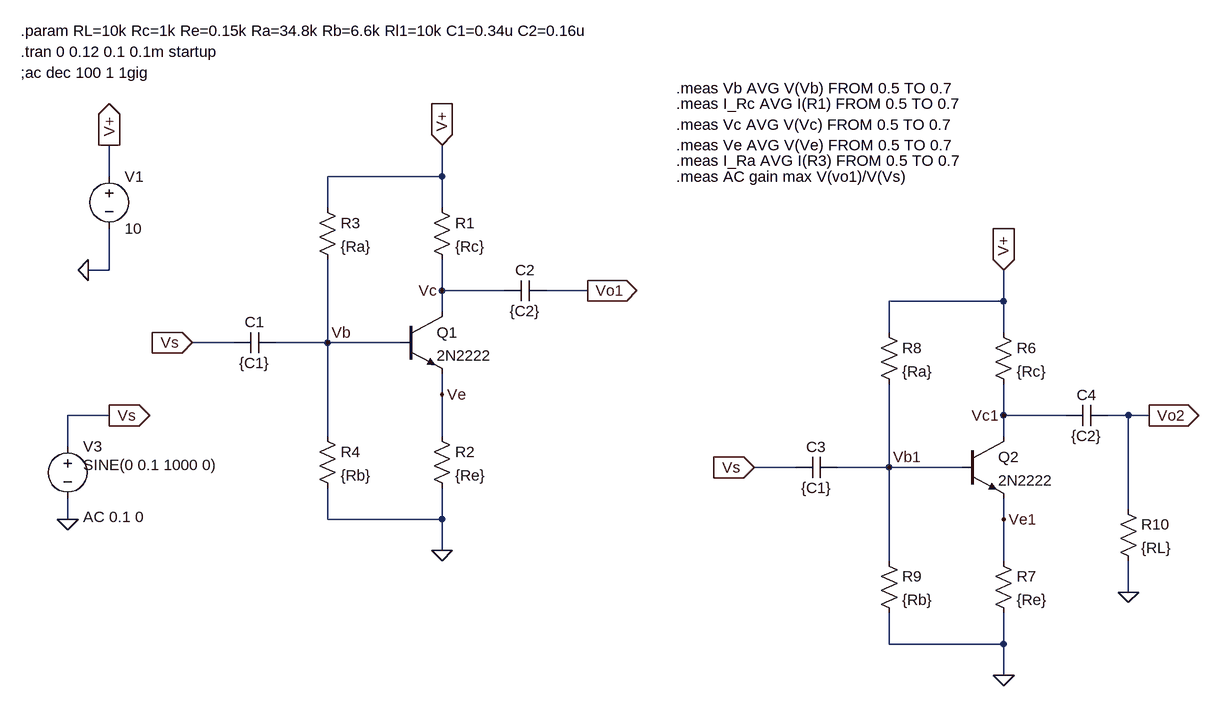
[diagram p0: schematic Assignment1.1.asc]
Assignment1.1.asc, the LTspice schematic file:
Version 4
SHEET 1 1592 680
WIRE -112 -176 -112 -224
WIRE 400 -176 400 -224
WIRE 400 -176 224 -176
WIRE 224 -128 224 -176
WIRE 400 -128 400 -176
WIRE -112 -32 -112 -96
WIRE -112 -32 -144 -32
WIRE 400 0 400 -48
WIRE 496 0 400 0
WIRE 624 0 560 0
WIRE 1264 16 1264 -32
WIRE 1264 16 1088 16
WIRE 400 32 400 0
WIRE 1088 64 1088 16
WIRE 1264 64 1264 16
WIRE 80 80 16 80
WIRE 224 80 224 -48
WIRE 224 80 144 80
WIRE 336 80 224 80
WIRE 400 160 400 128
WIRE -112 192 -176 192
WIRE 1264 192 1264 144
WIRE 1360 192 1264 192
WIRE 1456 192 1424 192
WIRE 1488 192 1456 192
WIRE 224 224 224 80
WIRE 400 224 400 160
WIRE 1264 224 1264 192
WIRE -176 240 -176 192
WIRE 944 272 880 272
WIRE 1088 272 1088 144
WIRE 1088 272 1008 272
WIRE 1200 272 1088 272
WIRE 1456 336 1456 192
WIRE -176 352 -176 320
WIRE 224 352 224 304
WIRE 400 352 400 304
WIRE 400 352 224 352
WIRE 1264 352 1264 320
WIRE 400 400 400 352
WIRE 1088 416 1088 272
WIRE 1264 416 1264 352
WIRE 1456 464 1456 416
WIRE 1088 544 1088 496
WIRE 1264 544 1264 496
WIRE 1264 544 1088 544
WIRE 1264 592 1264 544
FLAG -144 -32 0
FLAG 400 400 0
FLAG -112 -224 V+
IOPIN -112 -224 Out
FLAG 400 -224 V+
IOPIN 400 -224 In
FLAG 624 0 Vo1
IOPIN 624 0 Out
FLAG -176 352 0
FLAG -112 192 Vs
IOPIN -112 192 Out
FLAG 16 80 Vs
IOPIN 16 80 In
FLAG 400 0 Vc
FLAG 224 80 Vb
FLAG 400 160 Ve
FLAG 1264 592 0
FLAG 1264 -32 V+
IOPIN 1264 -32 In
FLAG 1488 192 Vo2
IOPIN 1488 192 Out
FLAG 1456 464 0
FLAG 880 272 Vs
IOPIN 880 272 In
FLAG 1264 192 Vc1
FLAG 1088 272 Vb1
FLAG 1264 352 Ve1
SYMBOL npn 336 32 R0
SYMATTR InstName Q1
SYMATTR Value 2N2222
SYMBOL res 384 -144 R0
SYMATTR InstName R1
SYMATTR Value {Rc}
SYMBOL res 384 208 R0
SYMATTR InstName R2
SYMATTR Value {Re}
SYMBOL res 208 -144 R0
SYMATTR InstName R3
SYMATTR Value {Ra}
SYMBOL res 208 208 R0
SYMATTR InstName R4
SYMATTR Value {Rb}
SYMBOL voltage -112 -192 R0
SYMATTR InstName V1
SYMATTR Value 10
SYMBOL cap 144 64 R90
WINDOW 0 0 32 VBottom 2
WINDOW 3 32 32 VTop 2
SYMATTR InstName C1
SYMATTR Value {C1}
SYMBOL cap 560 -16 R90
WINDOW 0 0 32 VBottom 2
WINDOW 3 32 32 VTop 2
SYMATTR InstName C2
SYMATTR Value {C2}
SYMBOL voltage -176 224 R0
WINDOW 123 24 124 Left 2
WINDOW 39 0 0 Left 0
WINDOW 3 24 44 Left 2
SYMATTR Value2 AC 0.1 0
SYMATTR Value SINE(0 0.1 1000 0)
SYMATTR InstName V3
SYMBOL npn 1200 224 R0
SYMATTR InstName Q2
SYMATTR Value 2N2222
SYMBOL res 1248 48 R0
SYMATTR InstName R6
SYMATTR Value {Rc}
SYMBOL res 1248 400 R0
SYMATTR InstName R7
SYMATTR Value {Re}
SYMBOL res 1072 48 R0
SYMATTR InstName R8
SYMATTR Value {Ra}
SYMBOL res 1072 400 R0
SYMATTR InstName R9
SYMATTR Value {Rb}
SYMBOL cap 1008 256 R90
WINDOW 0 0 32 VBottom 2
WINDOW 3 32 32 VTop 2
SYMATTR InstName C3
SYMATTR Value {C1}
SYMBOL cap 1424 176 R90
WINDOW 0 0 32 VBottom 2
WINDOW 3 32 32 VTop 2
SYMATTR InstName C4
SYMATTR Value {C2}
SYMBOL res 1440 320 R0
SYMATTR InstName R10
SYMATTR Value {RL}
TEXT -248 -400 Left 2 !.param RL=10k Rc=1k Re=0.15k Ra=34.8k Rb=6.6k Rl1=10k C1=0.34u C2=0.16u
TEXT -248 -368 Left 2 !.tran 0 0.12 0.1 0.1m startup
TEXT -248 -336 Left 2 !;ac dec 100 1 1gig
TEXT 760 -256 Left 2 !.meas Vc AVG V(Vc) FROM 0.5 TO 0.7
TEXT 760 -288 Left 2 !.meas I_Rc AVG I(R1) FROM 0.5 TO 0.7
TEXT 760 -312 Left 2 !.meas Vb AVG V(Vb) FROM 0.5 TO 0.7
TEXT 760 -200 Left 2 !.meas I_Ra AVG I(R3) FROM 0.5 TO 0.7
TEXT 760 -224 Left 2 !.meas Ve AVG V(Ve) FROM 0.5 TO 0.7
TEXT 760 -176 Left 2 !.meas AC gain max V(vo1)/V(Vs)

The netlist it stands for:
* Assignment1.1.asc
Q1 Vc Vb Ve 0 2N2222
R1 V+ Vc {Rc}
R2 Ve 0 {Re}
R3 V+ Vb {Ra}
R4 Vb 0 {Rb}
V1 V+ 0 10
C1 Vb Vs {C1}
C2 Vo1 Vc {C2}
V3 Vs 0 SINE(0 0.1 1000 0) AC 0.1 0
Q2 Vc1 Vb1 Ve1 0 2N2222
R6 V+ Vc1 {Rc}
R7 Ve1 0 {Re}
R8 V+ Vb1 {Ra}
R9 Vb1 0 {Rb}
C3 Vb1 Vs {C1}
C4 Vo2 Vc1 {C2}
R10 Vo2 0 {RL}
.model NPN NPN
.model PNP PNP
.lib standard.bjt
.param RL=10k Rc=1k Re=0.15k Ra=34.8k Rb=6.6k Rl1=10k C1=0.34u C2=0.16u
.tran 0 0.12 0.1 0.1m startup
;ac dec 100 1 1gig
.meas Vc AVG V(Vc) FROM 0.5 TO 0.7
.meas I_Rc AVG I(R1) FROM 0.5 TO 0.7
.meas Vb AVG V(Vb) FROM 0.5 TO 0.7
.meas I_Ra AVG I(R3) FROM 0.5 TO 0.7
.meas Ve AVG V(Ve) FROM 0.5 TO 0.7
.meas AC gain max V(vo1)/V(Vs)
.backanno
.end